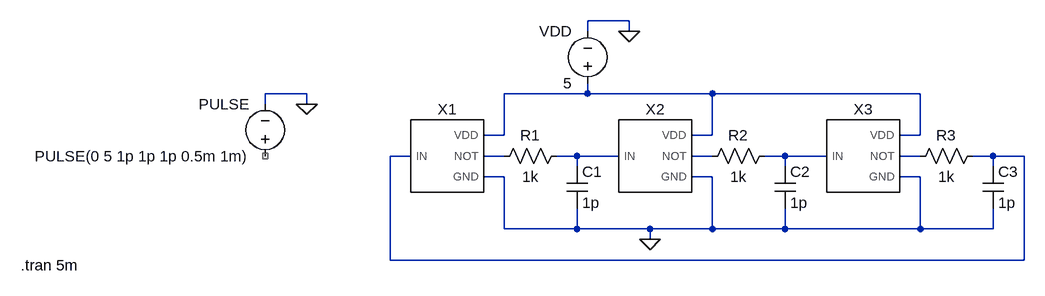
[diagram p0: schematic ringN.asc]
ringN.asc, the LTspice schematic file:
Version 4
SHEET 1 880 680
WIRE 192 -64 128 -64
WIRE 128 -48 128 -64
WIRE 192 -48 192 -64
WIRE -304 48 -368 48
WIRE 128 48 128 32
WIRE 128 48 0 48
WIRE 320 48 128 48
WIRE 640 48 320 48
WIRE -368 64 -368 48
WIRE -304 64 -304 48
WIRE 0 112 0 48
WIRE 0 112 -32 112
WIRE 320 112 320 48
WIRE 320 112 288 112
WIRE 640 112 640 48
WIRE 640 112 608 112
WIRE -144 144 -176 144
WIRE 0 144 -32 144
WIRE 112 144 80 144
WIRE 176 144 112 144
WIRE 320 144 288 144
WIRE 432 144 400 144
WIRE 496 144 432 144
WIRE 640 144 608 144
WIRE 752 144 720 144
WIRE 800 144 752 144
WIRE 112 160 112 144
WIRE 432 160 432 144
WIRE 752 160 752 144
WIRE 0 176 -32 176
WIRE 320 176 288 176
WIRE 640 176 608 176
WIRE 0 256 0 176
WIRE 112 256 112 224
WIRE 112 256 0 256
WIRE 224 256 112 256
WIRE 320 256 320 176
WIRE 320 256 224 256
WIRE 432 256 432 224
WIRE 432 256 320 256
WIRE 640 256 640 176
WIRE 640 256 432 256
WIRE 752 256 752 224
WIRE 752 256 640 256
WIRE 224 272 224 256
WIRE -176 304 -176 144
WIRE 800 304 800 144
WIRE 800 304 -176 304
FLAG 224 272 0
FLAG 192 -48 0
FLAG -304 64 0
SYMBOL not -96 144 R0
SYMATTR InstName X1
SYMBOL not 224 144 R0
SYMATTR InstName X2
SYMBOL not 544 144 R0
SYMATTR InstName X3
SYMBOL res 96 128 R90
WINDOW 0 0 56 VBottom 2
WINDOW 3 32 56 VTop 2
SYMATTR InstName R1
SYMATTR Value 1k
SYMBOL res 416 128 R90
WINDOW 0 0 56 VBottom 2
WINDOW 3 32 56 VTop 2
SYMATTR InstName R2
SYMATTR Value 1k
SYMBOL res 736 128 R90
WINDOW 0 0 56 VBottom 2
WINDOW 3 32 56 VTop 2
SYMATTR InstName R3
SYMATTR Value 1k
SYMBOL cap 96 160 R0
SYMATTR InstName C1
SYMATTR Value 1p
SYMBOL cap 416 160 R0
SYMATTR InstName C2
SYMATTR Value 1p
SYMBOL cap 736 160 R0
SYMATTR InstName C3
SYMATTR Value 1p
SYMBOL voltage 128 48 R180
WINDOW 0 24 96 Left 2
WINDOW 3 24 16 Left 2
SYMATTR InstName VDD
SYMATTR Value 5
SYMBOL voltage -368 160 R180
WINDOW 0 24 96 Left 2
WINDOW 3 24 16 Left 2
WINDOW 123 0 0 Left 0
WINDOW 39 0 0 Left 0
SYMATTR InstName PULSE
SYMATTR Value PULSE(0 5 1p 1p 1p 0.5m 1m)
TEXT -744 312 Left 2 !.tran 5m

The netlist it stands for:
* ringN.asc
XX1 N002 0 N003 N001 not  ; pins IN GND NOT VDD
XX2 N004 0 N005 N001 not  ; pins IN GND NOT VDD
XX3 N006 0 N007 N001 not  ; pins IN GND NOT VDD
R1 N004 N003 1k
R2 N006 N005 1k
R3 N002 N007 1k
C1 N004 0 1p
C2 N006 0 1p
C3 N002 0 1p
VDD N001 0 5
V§PULSE NC_01 0 PULSE(0 5 1p 1p 1p 0.5m 1m)
.tran 5m
.backanno
.end